# Altium schematic sheet Top.SchDoc: Top Level
size A3; CompanyName: NOT USED; DocumentNumber: 1; SheetNumber: 1; SheetTotal: 1; PageSetup: Record=PageOptions|CenterHorizontal=True|CenterVertical=True|PrintScale=1.00|XCorrection=1.00|YCorrection=1.00|PrintKind=0|BorderSize=5000000|LeftOffset=0|BottomOffset=0|Orientation=2|PaperLength=1000|PaperWidth=1000|Scale=100|PaperSource=7|PrintQuality=-4|MediaType=1|DitherType=10|PaperKind=A3|PrintScaleMode=0
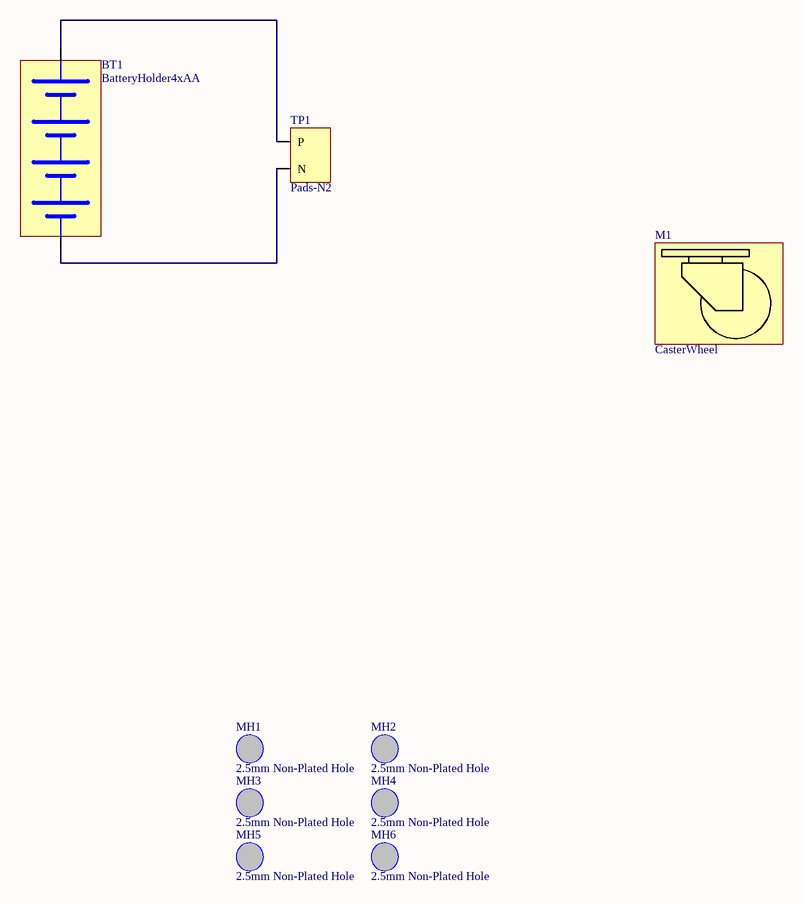
[diagram p0: Top.SchDoc]

## Parts
BT1  BatteryHolder4xAA  [BATTERY_HOLDER_4AA]
M1  CasterWheel  [CASTER_WHEEL]
MH1  2.5mm Non-Plated Hole  [MTG250X550]  (no BOM)
MH2  2.5mm Non-Plated Hole  [MTG250X550]  (no BOM)
MH3  2.5mm Non-Plated Hole  [MTG250X550]  (no BOM)
MH4  2.5mm Non-Plated Hole  [MTG250X550]  (no BOM)
MH5  2.5mm Non-Plated Hole  [MTG250X550]  (no BOM)
MH6  2.5mm Non-Plated Hole  [MTG250X550]  (no BOM)
TP1  Pads-N2  [PADS-N2]

## Nets
NetBT1_1: BT1.1(+) TP1.2(P)
NetBT1_2: BT1.2(-) TP1.1(N)

## Notes on the sheet
- Project
- Size:
- Date:
- A3
- Revision:
- Sheet
- of
- Lambo
- File:

## Library data of the parts
MH1-MH6 = NONPART-007: Display_Name: 2.5mm Non-Plated Hole; BWA PN: NONPART-007; Schematic Symbol: HOLE_UNPLATED